# EAGLE design main (EAGLE 7.4.0)
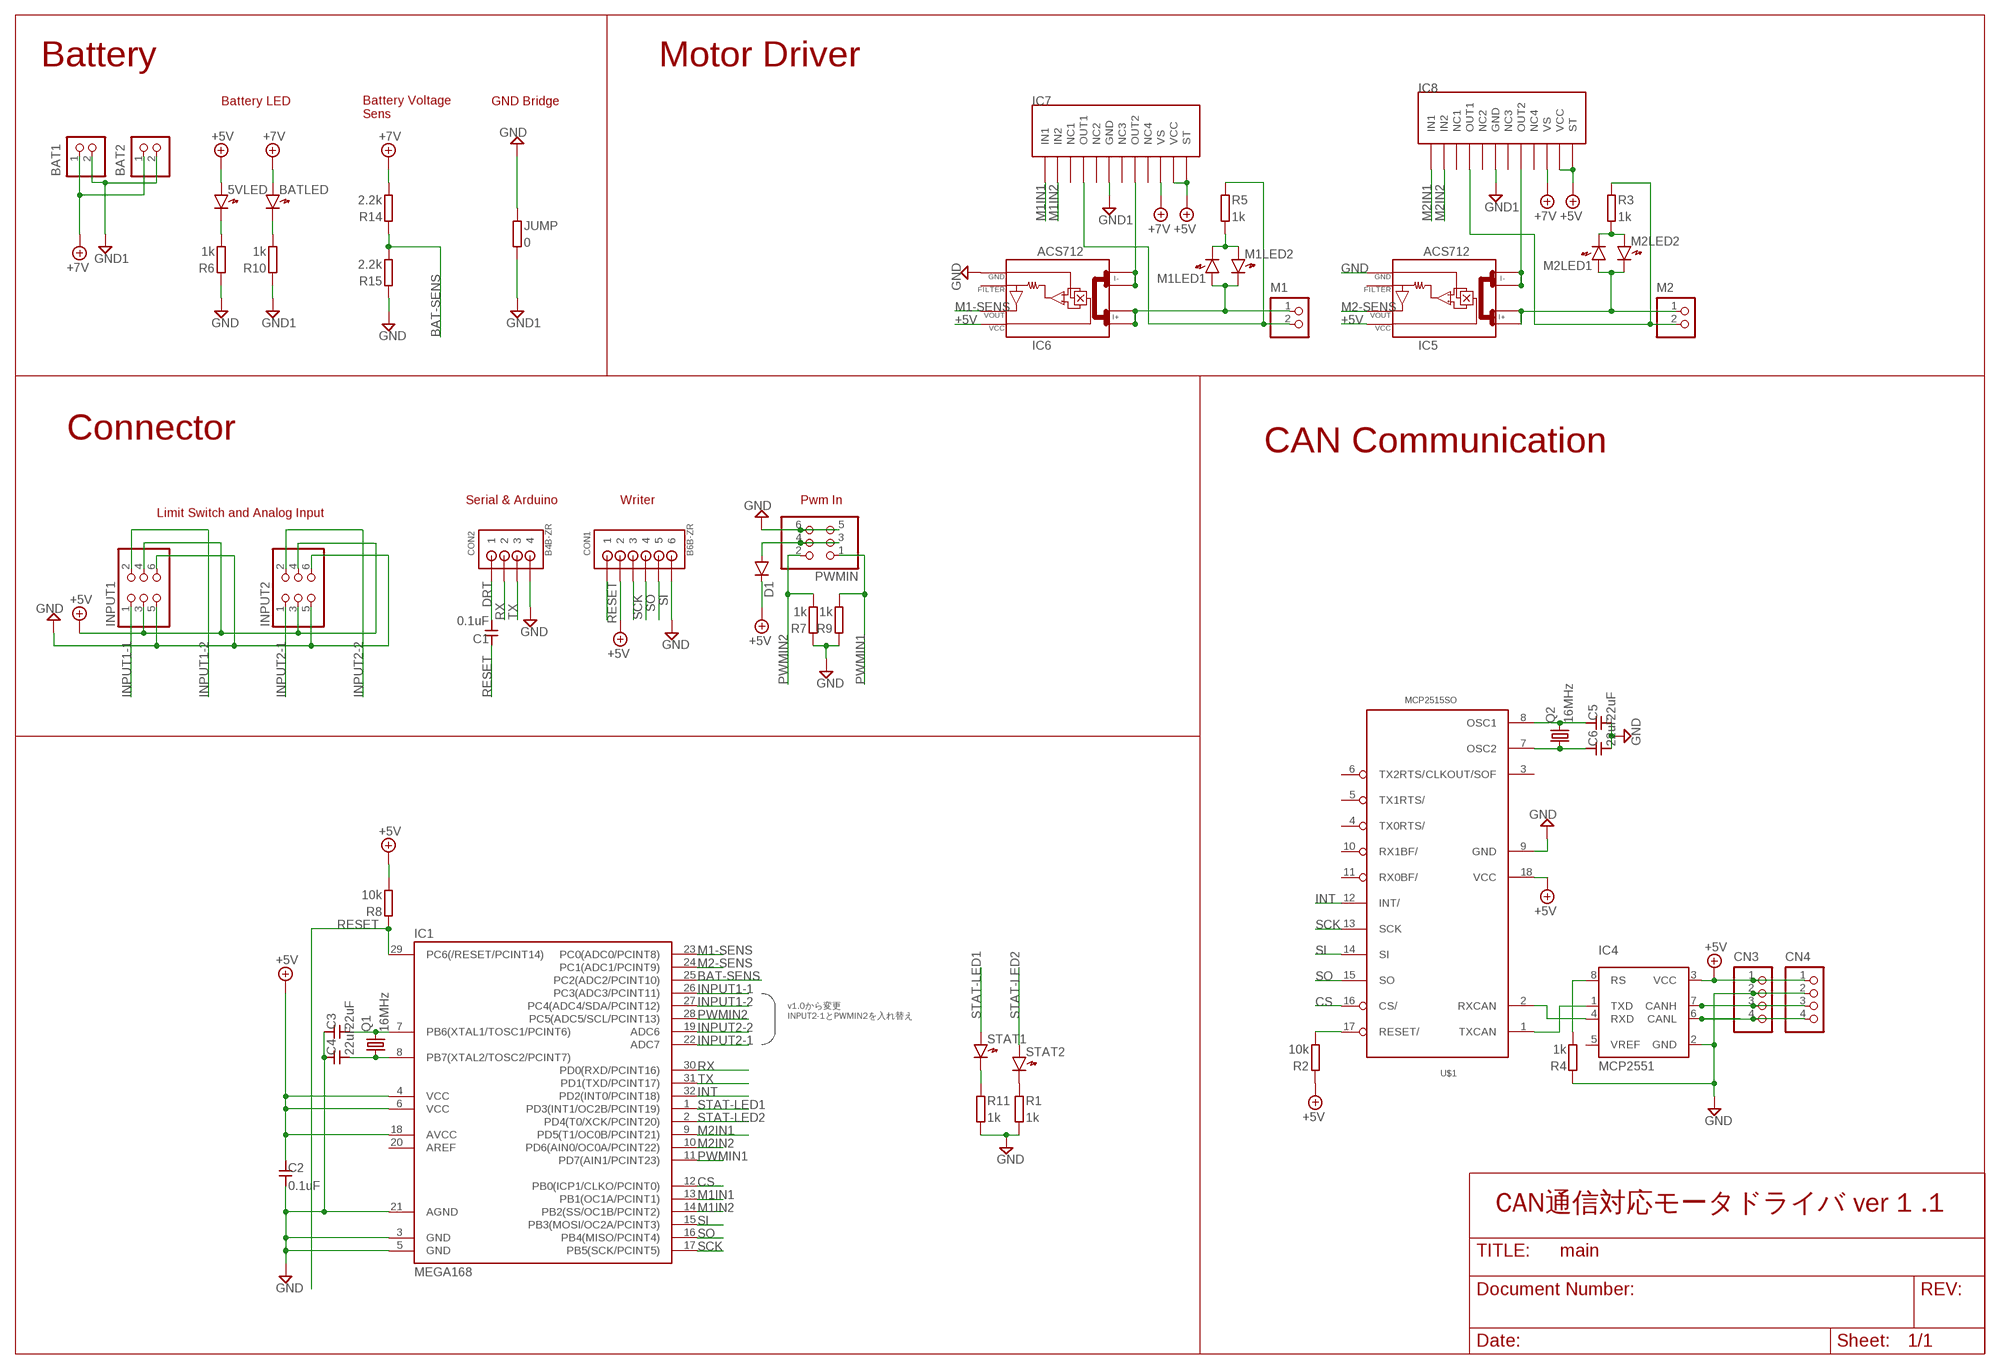
[diagram p0: schematic, sheet 1]

## Parts
5VLED  LED2012  [LED2012]
BAT1  B2P-VH  [B2P-VH]
BAT2  B2P-VH  [B2P-VH]
BATLED  LED2012  [LED2012]
C1  0.1uF  CAPACITOR2012  [SMD2012]
C2  0.1uF  CAPACITOR2012  [SMD2012]
C3  22uF  CAPACITOR2012  [SMD2012]
C4  22uF  CAPACITOR2012  [SMD2012]
C5  22uF  CAPACITOR2012  [SMD2012]
C6  22uF  CAPACITOR2012  [SMD2012]
CN3  B4B-PH-K-S  [B4B-PH-K-S]
CN4  B4B-PH-K-S  [B4B-PH-K-S]
CON1  B6B-ZR  [B6B-ZR]
CON2  B4B-ZR  [B4B-ZR]
D1  DIODESOD123  [SOD-123]
IC1  MEGA168  MEGA48/88/168-AU  [TQFP32-08]
IC4  MCP2551  [SOIC]
IC5  ACS712  [SO08]
IC6  ACS712  [SO08]
IC7  TA8429H  [TA8429H]
IC8  TA8429H  [TA8429H]
INPUT1  PINHD-2X3  [2X03]
INPUT2  PINHD-2X3  [2X03]
JUMP  0  RESISTOR2012  [SMD2012]
M1  B2P-VH  [B2P-VH]
M1LED1  LED2012  [LED2012]
M1LED2  LED2012  [LED2012]
M2  B2P-VH  [B2P-VH]
M2LED1  LED2012  [LED2012]
M2LED2  LED2012  [LED2012]
PWMIN  PINHD-2X3  [2X03]
Q1  16MHz  CRYSTALHC49S  [HC49/S]
Q2  16MHz  CRYSTALHC49S  [HC49/S]
R1  1k  RESISTOR2012  [SMD2012]
R2  10k  RESISTOR2012  [SMD2012]
R3  1k  RESISTOR2012  [SMD2012]
R4  1k  RESISTOR2012  [SMD2012]
R5  1k  RESISTOR2012  [SMD2012]
R6  1k  RESISTOR2012  [SMD2012]
R7  1k  RESISTOR2012  [SMD2012]
R8  10k  RESISTOR2012  [SMD2012]
R9  1k  RESISTOR2012  [SMD2012]
R10  1k  RESISTOR2012  [SMD2012]
R11  1k  RESISTOR2012  [SMD2012]
R14  2.2k  RESISTOR2012  [SMD2012]
R15  2.2k  RESISTOR2012  [SMD2012]
STAT1  LED2012  [LED2012]
STAT2  LED2012  [LED2012]
U$1  MCP2515SO  [SO18L]

## Nets
+5V: 5VLED.A C2.1 CN3.1 CN4.1 CON1.2 D1.C IC1.4(VCC) IC1.6(VCC) IC1.18(AVCC) IC4.3(VCC) IC5.8(VCC) IC6.8(VCC) IC7.P$11(VCC) IC7.P$12(ST) IC8.P$11(VCC) IC8.P$12(ST) INPUT1.3 INPUT1.4 INPUT2.3 INPUT2.4 R2.1 R8.2 U$1.18(VCC)
+7V: BAT1.1 BAT2.1 BATLED.A IC7.P$10(VS) IC8.P$10(VS) R14.2
BAT-SENS: IC1.25(PC2(ADC2/PCINT10)) R14.1 R15.2
CS: IC1.12(PB0(ICP1/CLKO/PCINT0)) U$1.16(CS/)
DRT: C1.2 CON2.1
GND: C2.2 C3.1 C4.1 C5.2 C6.2 CN3.2 CN4.2 CON1.6 CON2.4 IC1.3(GND) IC1.5(GND) IC1.21(AGND) IC4.2(GND) IC5.5(GND) IC6.5(GND) INPUT1.5 INPUT1.6 INPUT2.5 INPUT2.6 JUMP.1 PWMIN.5 PWMIN.6 R1.2 R4.1 R6.1 R7.1 R9.1 R11.2 R15.1 U$1.9(GND)
INPUT1-1: IC1.26(PC3(ADC3/PCINT11)) INPUT1.1
INPUT1-2: IC1.27(PC4(ADC4/SDA/PCINT12)) INPUT1.2
INPUT2-1: IC1.22(ADC7) INPUT2.1
INPUT2-2: IC1.19(ADC6) INPUT2.2
INT: IC1.32(PD2(INT0/PCINT18)) U$1.12(INT/)
M1-SENS: IC1.23(PC0(ADC0/PCINT8)) IC6.7(VOUT)
M1IN1: IC1.13(PB1(OC1A/PCINT1)) IC7.P$1(IN1)
M1IN2: IC1.14(PB2(SS/OC1B/PCINT2)) IC7.P$2(IN2)
M2-SENS: IC1.24(PC1(ADC1/PCINT9)) IC5.7(VOUT)
M2IN1: IC1.9(PD5(T1/OC0B/PCINT21)) IC8.P$1(IN1)
M2IN2: IC1.10(PD6(AIN0/OC0A/PCINT22)) IC8.P$2(IN2)
MGND [GND_MOTOR]: BAT1.2 BAT2.2 IC7.P$6(GND) IC8.P$6(GND) JUMP.2 R10.1 ; supply symbol labelled GND1
N$1: C3.2 IC1.7(PB6(XTAL1/TOSC1/PCINT6)) Q1.2
N$2: C4.2 IC1.8(PB7(XTAL2/TOSC2/PCINT7)) Q1.1
N$3 [V_MOTOR]: IC8.P$4(OUT1) M2.2 R3.1
N$4: IC6.1(I+_0) IC6.2(I+_1) M1.1 M1LED1.A M1LED2.K
N$5: D1.A PWMIN.3 PWMIN.4
N$7 [V_MOTOR]: IC5.1(I+_0) IC5.2(I+_1) M2.1 M2LED1.A M2LED2.K
N$13: IC4.1(TXD) U$1.1(TXCAN)
N$14: IC4.4(RXD) U$1.2(RXCAN)
N$21: 5VLED.K R6.2
N$28: R1.1 STAT2.K
N$32: CN3.4 CN4.4 IC4.6(CANL)
N$33: CN3.3 CN4.3 IC4.7(CANH)
N$34: M1LED1.K M1LED2.A R5.2
N$35 [GND_MOTOR]: IC7.P$4(OUT1) M1.2 R5.1
N$38: R2.2 U$1.17(RESET/)
N$39: M2LED1.K M2LED2.A R3.2
N$40: C6.1 Q2.1 U$1.7(OSC2)
N$41: BATLED.K R10.2
N$42: IC6.3(I-_0) IC6.4(I-_1) IC7.P$8(OUT2)
N$43: IC5.3(I-_0) IC5.4(I-_1) IC8.P$8(OUT2)
N$44: C5.1 Q2.2 U$1.8(OSC1)
N$45: IC4.8(RS) R4.2
N$47: R11.1 STAT1.K
PWMIN1: IC1.11(PD7(AIN1/PCINT23)) PWMIN.1 R9.2
PWMIN2: IC1.28(PC5(ADC5/SCL/PCINT13)) PWMIN.2 R7.2
RESET: C1.1 CON1.1 IC1.29(PC6(/RESET/PCINT14)) R8.1
RX: CON2.2 IC1.30(PD0(RXD/PCINT16))
SCK: CON1.3 IC1.17(PB5(SCK/PCINT5)) U$1.13(SCK)
SI: CON1.5 IC1.15(PB3(MOSI/OC2A/PCINT3)) U$1.14(SI)
SO: CON1.4 IC1.16(PB4(MISO/PCINT4)) U$1.15(SO)
STAT-LED1: IC1.1(PD3(INT1/OC2B/PCINT19)) STAT1.A
STAT-LED2: IC1.2(PD4(T0/XCK/PCINT20)) STAT2.A
TX: CON2.3 IC1.31(PD1(TXD/PCINT17))
Unconnected: IC1.20(AREF) IC4.5(VREF) IC5.6(FILTER) IC6.6(FILTER) IC7.P$3(NC1) IC7.P$5(NC2) IC7.P$7(NC3) IC7.P$9(NC4) IC8.P$3(NC1) IC8.P$5(NC2) IC8.P$7(NC3) IC8.P$9(NC4) U$1.3(CLKOUT/SOF) U$1.4(TX0RTS/) U$1.5(TX1RTS/) U$1.6(TX2RTS/) U$1.10(RX1BF/) U$1.11(RX0BF/)

## Notes on the sheet
- Battery | Motor Driver
- Battery LED | GND Bridge
- Battery Voltage
  Sens
- Connector
- CAN Communication
- Serial & Arduino | Writer | Pwm In
- Limit Switch and Analog Input
- v1.0から変更
  INPUT2-1とPWMIN2を入れ替え
- CAN通信対応モータドライバ ver 1 .1

## Library data of the parts
5VLED BATLED M1LED1 M1LED2 M2LED1 M2LED2 STAT1 STAT2 = generic:LED: Generic LEDs
BAT1 BAT2 M1 M2 = jst-vh:B2P-VH: Wire-to-Board 3.96mm pitch top mount connector Source: http://www.jst-mfg.com/product/pdf/jpn/VH.pdf http://www.jst-mfg.com/product/detail.php?series=262
C1-C6 = generic:CAPACITOR: Generic Capacitor
CN3 CN4 = jst-ph:B4B-PH-*: Wire-to-Board 2.0mm pitch top mount connector Source: http://www.jst-mfg.com/product/pdf/jpn/PH.pdf http://www.jst-mfg.com/product/detail.php?series=199
CON1 = jst:B6B-ZR: JST-ZH Connector 6 pol, 1.5mm pitch Package: B6B-ZR Source: http://www.jst-mfg.com/product/pdf/eng/eZH.pdf
CON2 = jst:B4B-ZR: JST-ZH Connector 4 pol, 1.5mm pitch Package: B4B-ZR Source: http://www.jst-mfg.com/product/pdf/eng/eZH.pdf
D1 = SparkFun-DiscreteSemi:DIODE: Diode These are standard reverse protection diodes and small signal diodes. SMA package can handle up to about 1A. SOD-323 can handle about 200mA. What the SOD-323 package when ordering, there are some mfgs out there that are 5-pin packages.
IC1 = avr-5:MEGA48/88/168
IC4 = mcp2551:MCP2551
IC5 IC6 = ACS712:ACS712
IC7 IC8 = TA8429H:TA8429H: TA8429H Toshiba motor driver.
INPUT1 INPUT2 PWMIN = pinhead:PINHD-2X3: PIN HEADER
JUMP R1-R11 R14 R15 = generic:RESISTOR: Generic Registor
Q1 Q2 = crystal:CRYSTAL: CRYSTAL; OC_FARNELL: 1667008; OC_NEWARK: unknown
U$1 = MCP2515_MT:MCP2515*: MCP2515 Standalone CAN-Controller by Microchip Eagle-Lib. by MartinThomas

## Board
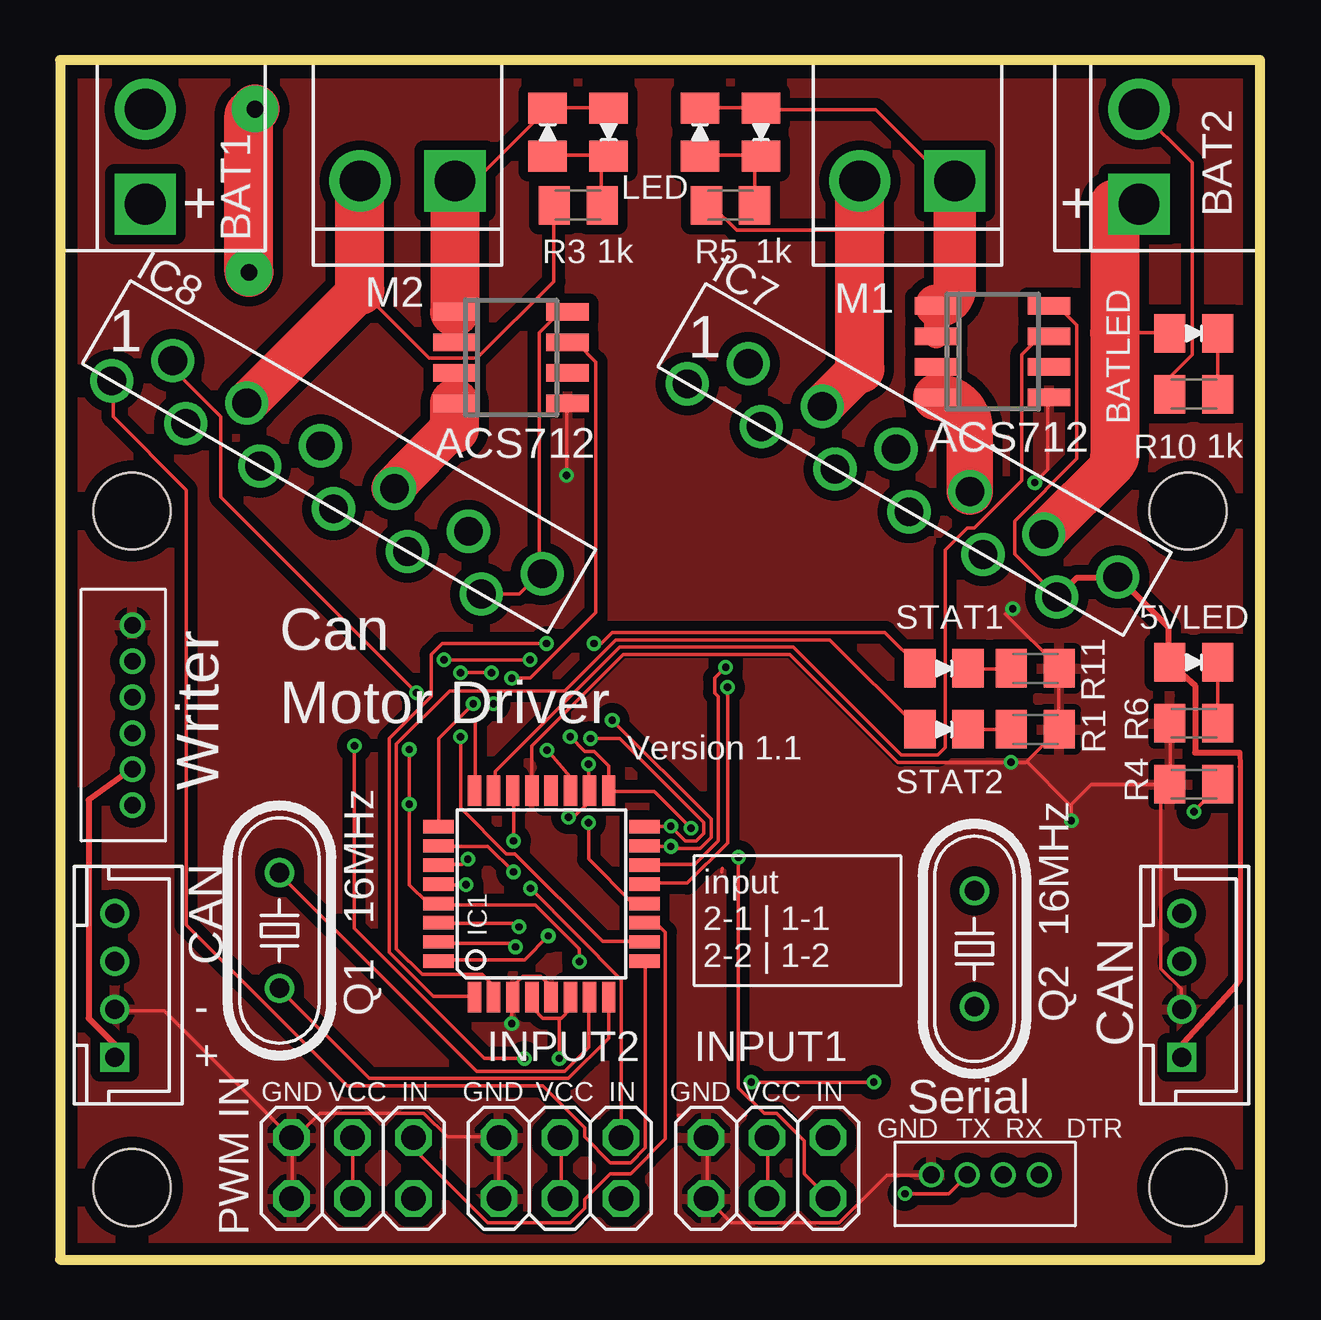
[diagram p1: board, top side]
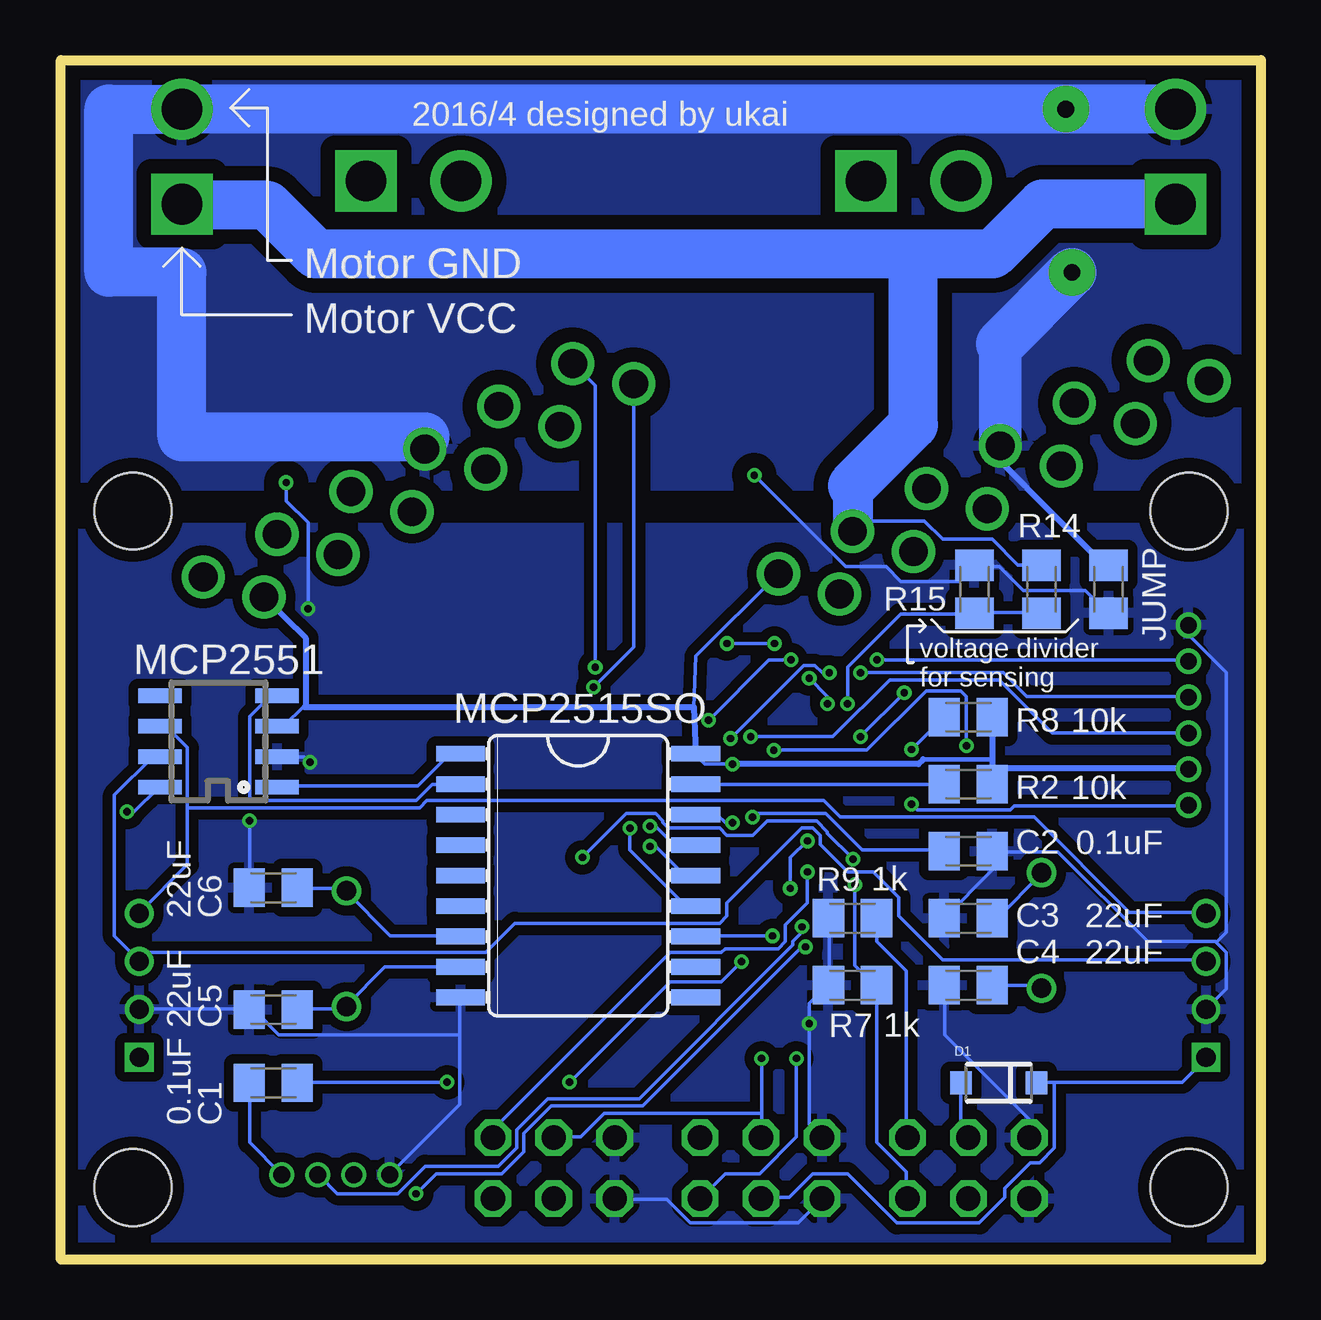
[diagram p2: board, bottom side, seen from below]

Size 50 x 50 mm. Coordinates in mm from the lower left corner, seen from the top.
Outline: 0,0 50,0 50,50 0,50 0,0
Copper layers (1*16): Top 0.035mm / dielectric 1.6mm / Bottom 0.035mm
Design rules "Elecrow_2-layer_PCB_eagle_rule": minimum track width 6mil, minimum drill 12mil, track to track 6mil, track to pad 6mil, pad to pad 6mil, via to via 8mil, smd to smd 0mil, copper to edge 20mil, drill to drill 10mil, minimum pad ring 6mil, minimum via ring 6mil, stop-mask expansion 0mil, vias tented up to drill 100mil, thermal gap 10mil
Holes 3.2 mm at 3,3 47,3 3,31.2 47,31.2

### Footprints (pad centres in the part's own frame; a part is rotated, then mirrored left to right if it is on the bottom)
LED2012 = smd 1.3 x 1.6: A -1,0; K 1,0
B2P-VH = drill 1.7 square: 1 -1.98,0 | drill 1.7: 2 1.98,0
SMD2012 = smd 1.3 x 1.6: 1 -1,0; 2 1,0
B4B-PH-K-S = drill 0.8 square: 1 -3,0 | drill 0.8: 2 -1,0; 3 1,0; 4 3,0
B6B-ZR = drill 0.7: 1 9,-1.3; 2 7.5,-1.3; 3 6,-1.3; 4 4.5,-1.3; 5 3,-1.3; 6 1.5,-1.3
B4B-ZR = drill 0.7: 1 6,-1.3; 2 4.5,-1.3; 3 3,-1.3; 4 1.5,-1.3
SOD-123 = smd 0.9 x 0.95: A 1.575,0; C -1.575,0
TQFP32-08 = smd 1.27 x 0.559: 1 -4.293,2.8; 2 -4.293,2; 3 -4.293,1.2; 4 -4.293,0.4; 5 -4.293,-0.4; 6 -4.293,-1.2; 7 -4.293,-2; 8 -4.293,-2.8; 17 4.293,-2.8; 18 4.293,-2; 19 4.293,-1.2; 20 4.293,-0.4; 21 4.293,0.4; 22 4.293,1.2; 23 4.293,2; 24 4.293,2.8 | smd 0.559 x 1.27: 9 -2.8,-4.293; 10 -2,-4.293; 11 -1.2,-4.293; 12 -0.4,-4.293; 13 0.4,-4.293; 14 1.2,-4.293; 15 2,-4.293; 16 2.8,-4.293; 25 2.8,4.293; 26 2,4.293; 27 1.2,4.293; 28 0.4,4.293; 29 -0.4,4.293; 30 -1.2,4.293; 31 -2,4.293; 32 -2.8,4.293
SOIC = smd 0.6 x 1.8: 1 -1.905,-2.44; 2 -0.635,-2.44; 3 0.635,-2.44; 4 1.905,-2.44; 5 1.905,2.44; 6 0.635,2.44; 7 -0.635,2.44; 8 -1.905,2.44
SO08 = smd 0.72 x 1.78: 1 -1.905,-2.35; 2 -0.635,-2.35; 3 0.635,-2.35; 4 1.905,-2.35; 5 1.905,2.35; 6 0.635,2.35; 7 -0.635,2.35; 8 -1.905,2.35
TA8429H = drill 1.2: P$1 0,0; P$2 1.778,2; P$3 3.556,0; P$4 5.334,2; P$5 7.112,0; P$6 8.89,2; P$7 10.668,0; P$8 12.446,2; P$9 14.224,0; P$10 16.002,2; P$11 17.78,0; P$12 19.558,2
2X03 = drill 1.016 octagon: 1 -2.54,-1.27; 2 -2.54,1.27; 3 0,-1.27; 4 0,1.27; 5 2.54,-1.27; 6 2.54,1.27
HC49/S = drill 0.813: 1 -2.413,0; 2 2.413,0
SO18L = smd 0.66 x 2.032: 1 -5.08,-4.902; 2 -3.81,-4.902; 3 -2.54,-4.902; 4 -1.27,-4.902; 5 0,-4.902; 6 1.27,-4.902; 7 2.54,-4.902; 8 3.81,-4.902; 9 5.08,-4.902; 10 5.08,4.902; 11 3.81,4.902; 12 2.54,4.902; 13 1.27,4.902; 14 0,4.902; 15 -1.27,4.902; 16 -2.54,4.902; 17 -3.81,4.902; 18 -5.08,4.902

### Placement (x,y rotation side)
5VLED  47.24,24.89 0 top
BAT1  3.56,45.97 90 top
BAT2  44.96,45.97 90 top
BATLED  47.24,38.61 0 top
C1  41.15,7.37 180 bottom
C2  12.19,17.02 0 bottom
C3  12.19,14.22 0 bottom
C4  12.19,11.43 0 bottom
C5  41.15,10.41 180 bottom
C6  41.15,15.49 180 bottom
CN3  46.74,11.43 90 top
CN4  2.29,11.43 90 top
CON1  4.32,27.94 270 top
CON2  34.8,4.83 0 top
D1  10.92,7.37 180 bottom
IC1  20.07,15.24 90 top
IC4  43.43,21.59 90 bottom
IC5  18.8,37.59 270 top
IC6  38.86,37.85 270 top
IC7  26.14,36.5 330 top
IC8  2.16,36.63 330 top
INPUT1  29.46,3.81 180 top
INPUT2  20.83,3.81 180 top
JUMP  6.35,27.94 90 bottom
M1  35.31,44.96 180 top
M1LED1  29.21,46.99 270 top
M1LED2  26.67,46.99 90 top
M2  14.48,44.96 180 top
M2LED1  22.86,46.99 270 top
M2LED2  20.32,46.99 90 top
PWMIN  12.19,3.81 180 top
Q1  9.14,13.72 90 top
Q2  38.1,12.95 270 top
R1  40.64,22.1 0 top
R2  12.19,19.81 180 bottom
R3  21.59,43.94 0 top
R4  47.24,19.81 0 top
R5  27.94,43.94 0 top
R6  47.24,22.35 0 top
R7  17.02,11.43 0 bottom
R8  12.19,22.61 0 bottom
R9  17.02,14.22 0 bottom
R10  47.24,36.07 0 top
R11  40.64,24.64 0 top
R14  9.14,27.94 90 bottom
R15  11.94,27.94 270 bottom
STAT1  36.83,24.64 0 top
STAT2  36.83,22.1 0 top
U$1  28.45,16 270 bottom

### Tracks (layer width: path | path; a pad name or v marks a point on that pad's centre or on a via)
+5V  (via drill 0.3)
  Top 0.152: IC6.8 41.22,39.7 41.6,39.7 42.37,38.94 42.37,33.38 39.78,30.79 39.78,29.41 41.53,27.66 IC7.P$11 41.6,27.66 | 46.18,24.92 5VLED.A 46.25,24.84 | 46.79,8.46 CN3.1 | v22.02,20.65 22.02,19.58 IC1.18 22.02,19.51 22.02,19.05 21.41,18.44 v21.18,18.44 | 20.04,28.57 20,28.61 | 20,28.61 19.96,28.65 19.96,38.63 20.8,39.47 21.11,39.47 IC5.8 | INPUT1.4 29.49,2.59 29.49,5.03 INPUT1.3 | 20.8,10.06 20.88,10.06 21.26,10.44 21.26,10.9 IC1.6 | 20.8,10.06 20.12,10.06 19.74,10.44 19.74,10.9 IC1.4 | v20.8,8.38 20.8,10.06 | INPUT2.4 20.88,2.59 20.88,5.03 INPUT2.3 | 2.97,20.42 CON1.2 | IC8.P$11 17.6,27.74 19.13,27.74 19.96,28.57 IC8.P$12 20.04,28.65 20,28.61 | 44.12,28.42 IC7.P$12 44.04,28.42
  Top 0.203: 49.15,21.13 49.17,20.55 49.17,11.66 49.02,11.48 49.02,11.46
  Top 0.254: 46.18,24.92 46.18,26.36 44.12,28.42 | 46.79,8.46 46.81,9.02 49.02,11.46 | 49.15,21.13 47.3,21.13 47.3,23.93 46.25,24.84 | CN4.1 2.29,8.97 1.19,10.06 1.19,19.15 2.97,20.42 | 44.04,28.42 42.37,28.42 41.6,27.66
  Bottom 0.152: 39.8,23.09 39.89,23.05 | 39.89,23.05 40.69,22.25 40.92,22.25 IC4.3 | v22.02,20.65 23.16,20.65 23.55,21.03 U$1.18 | v21.18,18.44 21.03,18.59 18.14,18.59 16.61,17.07 13.26,17.07 C2.1 | 23.62,23.01 23.55,25.15 20.12,28.57 IC8.P$12 | 20.8,6.1 20.8,5.11 INPUT2.3 | 20.8,6.1 v20.8,8.38 | 20.8,6.1 27.36,6.1 28.35,5.11 29.41,5.11 INPUT1.3 | 8.61,7.39 3.28,7.39 2.29,8.38 CN4.1 | 8.61,7.39 9.3,7.39 D1.C | 11.2,22.55 R8.2 | 3.05,20.5 CON1.2 | 8.61,7.39 8.61,4.65 9.22,4.04 9.6,4.04 10.67,2.97 10.67,2.59 11.73,1.52 15.16,1.52 17.22,3.58 18.67,3.58 19.66,2.59 20.8,2.59 INPUT2.4 | 39.85,23.01 39.89,23.05 | 41.53,27.58 IC7.P$11 | 11.2,20.5 11.2,19.81 R2.1 11.2,20.5
  Bottom 0.178: 11.2,20.85 14.07,20.85
  Bottom 0.254: 39.8,23.09 39.8,25.91 41.53,27.58 | U$1.18 23.62,23.01 39.85,23.01 | 11.2,22.55 11.2,20.85 11.2,20.5 3.05,20.5 | v22.02,20.65 14.28,20.65 14.07,20.85
+7V
  Top 0.152: 46.18,38.63 BATLED.A 46.1,38.63 43.94,38.63 | 41,30.25 IC7.P$10
  Top 1.778: 41,30.25 43.94,33.2 43.94,33.43
  Top 2.032: BAT2.1 43.94,43.99 43.94,38.63 43.94,33.43
  Bottom 0.152: R14.2 9.14,28.96 10.13,28.96 11.2,30.02 13.26,30.02 14.02,30.79 16.23,30.79 IC8.P$10
  Bottom 1.676: 17.02,32.26 IC8.P$10
  Bottom 2.032: BAT1.1 9.09,43.99 11.18,41.91 14.73,41.91 | 14.73,41.91 39.37,41.91 41.4,43.94 44.91,43.94 BAT2.1 | 17.02,32.26 14.48,34.8 14.48,41.66 14.73,41.91
BAT-SENS  (via drill 0.3)
  Top 0.152: v17.22,23.16 15.77,21.72 IC1.25
  Bottom 0.152: v17.22,23.16 17.22,24.69 15.01,26.9 11.96,26.9 R15.2 11.89,26.98 9.14,26.98 R14.1
CS  (via drill 0.3)
  Top 0.152: v22.02,18.21 22.02,16.69 23.85,14.86 24.31,14.86 IC1.12
  Bottom 0.152: v22.02,18.21 22.33,18.21 22.63,18.52 23.55,18.52 U$1.16
DRT
  Bottom 0.152: C1.2 42.14,7.32 42.14,4.88 40.84,3.58 CON2.1
GND  (via drill 0.3)
  Top 0.152: 41.6,22.1 41.6,24.61 R11.2 41.6,24.69 39.43,26.86 | R6.1 46.25,22.33 46.25,19.81 R4.1 | IC1.5 20.42,10.97 20.42,11.43 20.04,11.81 19.28,11.81 18.9,11.43 18.9,10.97 IC1.3 18.82,10.9 v18.82,9.83 | 41.6,22.1 40.27,20.77 | 40.27,20.77 40.23,20.73 v39.62,20.73 34.9,20.73 30.4,25.22 23.47,25.22 19.66,21.41 19.66,19.58 IC1.21 | 41.6,22.1 R1.2 | v42.14,18.29 42.14,18.9 42.1,18.94 | 40.27,20.77 42.1,18.94 | 39.43,26.86 39.4,26.9 | 41.15,35.89 IC6.5 41.15,35.81 41.15,32.92 v40.62,32.38 | 45.87,19.81 42.98,19.81 42.1,18.94 | 45.87,19.81 R4.1 | 45.87,19.81 45.87,12.12 46.71,11.28 46.71,10.44 CN3.2 | 46.18,19.81 R4.1 | INPUT2.6 INPUT2.5 18.29,5.11 16.15,5.11 15.16,6.1 10.82,6.1 9.75,5.03 PWMIN.5 | CN4.2 2.29,10.36 4.34,10.36 9.6,5.11 PWMIN.5 | PWMIN.6 9.68,2.59 9.68,5.03 PWMIN.5 | CON2.4 36.27,3.5 34.44,3.5 32.46,1.52 27.96,1.52 26.98,2.52 INPUT1.6 26.98,2.59 26.98,5.03 INPUT1.5 26.9,5.64 | 25.76,6.02 25.91,6.02 | 27.58,16.31 27.57,16.17 | 28.57,6.02 28.45,6.01 | v21.11,32.69 21.11,35.66 IC5.5 | 39.43,26.86 v39.7,27.13
  Bottom 0.152: C5.2 42.22,10.44 46.71,10.44 CN3.2 | 33.38,9.37 33.38,6.48 36.27,3.58 CON2.4 | 33.38,9.37 33.38,10.9 U$1.9 | 33.38,9.37 40.92,9.37 41.91,10.36 42.14,10.36 C5.2 | v42.14,18.29 42.14,15.54 C6.2 | IC4.2 39.85,20.95 v39.62,20.73 | R9.1 17.98,14.17 17.98,11.43 R7.1 18.06,11.43 18.82,10.67 v18.82,9.83 18.82,5.64 18.29,5.11 INPUT2.5 | INPUT1.6 26.9,2.52 24.77,2.52 23.77,1.52 19.28,1.52 18.29,2.52 INPUT2.6 | C3.1 13.18,14.25 11.2,16.23 11.2,16.99 C2.2 11.12,16.99 8.46,16.99 4.72,13.26 1.91,13.26 1.87,13.22 | C4.1 13.18,9.37 9.68,5.87 9.68,5.11 PWMIN.5 | 1.87,13.22 1.45,12.8 1.45,11.28 CN4.2 | 1.87,13.22 1.45,13.64 1.45,24.46 2.97,25.98 2.97,26.36 CON1.6 | v21.11,32.69 17.3,28.88 15.62,28.88 15.01,28.27 12.57,28.27 11.96,28.88 R15.1 11.89,28.88 10.9,28.88 9.91,27.89 7.32,27.89 6.4,26.98 JUMP.1 | v40.62,32.38 40.62,31.62 39.7,30.71 v39.7,27.13 | C5.2 42.14,10.44 42.03,10.54
  pour Top (isolate 0.406): 0.76,49.02 49.28,49.02 49.28,0.76 0.76,0.76
  pour Bottom (isolate 0.406): 0.76,30.48 49.28,30.48 49.28,0.76 0.76,0.76
INPUT1-1  (via drill 0.3)
  Top 0.152: v18.9,16.15 17.83,17.22 15.77,17.22 IC1.26
  Bottom 0.152: v18.9,16.15 18.9,14.86 19.81,13.95 19.81,13.26 20.12,12.95 22.33,12.95 22.48,12.8 24.61,12.8 32,5.41 INPUT1.1
INPUT1-2  (via drill 0.3)
  Top 0.152: v16.99,16.69 16.76,16.46 15.77,16.46 IC1.27 | v28.27,16.76 28.27,7.16 29.34,6.1 29.87,6.1 31.01,4.95 31.01,3.58 32,2.59 INPUT1.2
  Bottom 0.152: v16.99,16.69 18.06,17.75 18.06,17.83 18.52,18.29 20.57,18.29 21.18,17.68 22.25,17.68 22.55,17.98 24.69,17.98 24.92,18.21 24.92,18.29 25.22,18.59 26.44,18.59 v28.27,16.76
INPUT2-1  (via drill 0.3)
  Top 0.152: v19.61,15.47 23.39,11.66 23.39,5.11 23.37,5.11 INPUT2.1 | v18.9,17.45 18.9,19.53 IC1.22
  Bottom 0.152: v19.61,15.47 19.61,16.76 v18.9,17.45
INPUT2-2  (via drill 0.3)
  Top 0.152: v20.3,21.23 21.26,20.12 21.26,19.58 21.27,19.58 IC1.19 | v12.27,21.41 12.27,13.79 17.68,8.38 v19.36,8.38
  Bottom 0.152: v20.3,21.23 16.43,21.23 13.95,23.7 12.5,23.7 12.27,23.47 v12.27,21.41 | v19.36,8.38 19.36,5.11 20.88,3.58 22.33,3.58 INPUT2.2
INT  (via drill 0.3)
  Top 0.152: v20.34,13.49 19.36,12.5 15.77,12.5 IC1.32
  Bottom 0.152: v20.34,13.49 23.55,13.49 U$1.12
M1-SENS
  Top 0.152: IC6.7 40.84,38.48 40.08,37.72 40.08,32.46 38.1,30.48 37.8,30.48 36.88,29.57 36.88,21.34 36.58,21.03 35.05,21.03 30.56,25.53 23.32,25.53 18.14,20.34 18.14,19.58 IC1.23
M1IN1  (via drill 0.3)
  Top 0.152: v27.81,23.85 27.81,17.37 26.14,15.7 24.38,15.7 IC1.13
  Bottom 0.152: v27.81,23.85 26.14,25.53 IC7.P$1
M1IN2  (via drill 0.3)
  Top 0.152: v27.74,24.69 27.28,24.23 27.28,23.62 27.43,23.47 27.43,17.45 26.44,16.46 24.38,16.46 IC1.14
  Bottom 0.152: v27.74,24.69 27.74,36.42 28.65,37.34 IC7.P$2
M2-SENS  (via drill 0.3)
  Top 0.152: v18.06,23.16 17.3,22.4 17.3,19.58 IC1.24 | v18.82,24.23 19.58,24.23 22.33,26.98 22.33,37.41 21.57,38.18 21.18,38.18 IC5.7
  Bottom 0.152: v18.06,23.16 18.06,23.47 v18.82,24.23
M2IN1
  Top 0.152: IC1.9 24.38,12.42 24.38,4.65 23.77,4.04 22.94,4.04 21.87,5.11 21.87,5.49 20.12,7.24 11.96,7.24 5.26,13.95 5.26,32.08 2.21,35.13 2.21,36.58 IC8.P$1
M2IN2  (via drill 0.3)
  Top 0.152: v16.69,21.79 16.69,18.82 18.59,16.92 18.95,16.92 22.61,13.26 24.31,13.26 IC1.10 | 4.72,36.96 4.72,37.41 IC8.P$2 4.72,36.96 | 4.72,36.96 4.88,36.96 6.71,35.13 6.71,31.77 v14.86,23.62
  Bottom 0.152: v14.86,23.62 v16.69,21.79
MGND  (via drill 0.7 pad 1.93)
  Top 0.152: R10.1 46.25,36.12 46.25,36.8 47.17,37.72 47.17,45.72 44.96,47.93 BAT2.2
  Top 2.032: v7.87,41.15 7.87,47.7 v8.13,47.95
  Bottom 0.152: 9.75,32.16 9.84,32.26
  Bottom 0.254: IC8.P$6 10.86,33.28 9.84,32.26 | JUMP.2 6.54,28.94 9.75,32.16
  Bottom 1.778: IC8.P$6 10.86,38.16 | 10.86,38.16 | 34.83,34.29 IC7.P$6
  Bottom 2.032: BAT1.2 v8.13,47.95 BAT2.2 48.01,47.95 48.01,41.15 44.96,41.15 44.96,34.29 34.83,34.29 | 10.86,38.16 v7.87,41.15
  pour Bottom (isolate 0.61): 0.76,49.28 49.28,49.28 49.28,32.26 0.76,32.26
N$1
  Top 0.152: IC1.7 22.02,10.9 22.02,8.84 21.03,7.85 17.37,7.85 9.14,16.08 Q1.2
  Bottom 0.152: C3.2 11.12,14.25 10.97,14.25 9.14,16.08 Q1.2
N$2
  Top 0.152: IC1.8 22.86,10.9 22.86,9.22 21.18,7.54 12.88,7.54 9.14,11.28 Q1.1
  Bottom 0.152: C4.2 9.22,11.43 9.14,11.35 Q1.1
N$3
  Top 0.152: 12.5,40.4 13.26,39.78 13.26,39.7 15.39,37.57 17.37,37.57 20.57,40.77 20.57,43.89 R3.1 | 7.85,35.74 IC8.P$4
  Top 1.778: 7.8,35.69 IC8.P$4 12.5,40.4
  Top 2.032: 12.5,40.4 M2.2
N$4
  Top 0.152: 29.18,48.01 M1LED1.A | M1LED2.K 26.67,48.01 29.11,48.01 M1LED1.A | M1LED1.A 29.26,47.93 33.98,47.93 36.42,45.49 M1.1
  Top 1.016: IC6.1 IC6.2
  Top 1.778: M1.1 37.29,40.52 arc-90 IC6.1
N$5
  Top 0.152: PWMIN.3 PWMIN.4
  Bottom 0.152: D1.A 12.5,7.32 12.5,5.41 12.19,5.11 PWMIN.3
N$7
  Top 0.152: M2.1 17.45,45.11 20.27,47.93 M2LED2.K 20.34,48.01 22.86,48.01 M2LED1.A
  Top 0.61: IC5.1 IC5.2
  Top 2.032: M2.1 16.45,44.96 IC5.1
N$13
  Bottom 0.152: IC4.1 40.92,19.74 35.13,19.74 33.83,21.03 33.38,21.03 U$1.1
N$14
  Bottom 0.152: U$1.2 34.52,19.81 35.2,19.13 41.99,19.13 42.14,19.28 42.14,22.63 41.3,23.47 41,23.47 IC4.4
N$21
  Top 0.152: R6.2 48.23,22.4 48.23,24.84 5VLED.K
N$28
  Top 0.152: R1.1 STAT2.K
N$32
  Bottom 0.152: 44.73,18.82 44.73,16.46 46.71,14.48 CN3.4 | 44.73,18.82 44.73,21.34 45.57,22.17 45.87,22.17 IC4.6 | 44.73,18.82 35.05,18.82 34.75,19.13 18.21,19.13 17.53,18.44 9.45,18.44 5.49,14.48 2.29,14.48 CN4.4
N$33
  Bottom 0.152: IC4.7 46.18,20.95 47.78,19.36 47.78,13.49 46.79,12.5 CN3.3 46.71,12.5 46.41,12.8 32.31,12.8 31.09,14.02 22.55,14.02 22.25,14.33 22.25,14.86 19.13,17.98 18.67,17.98 18.36,17.68 18.36,17.3 17.22,16.15 16.15,16.15 15.09,15.09 15.09,14.33 13.26,12.5 2.29,12.5 CN4.3
N$34
  Top 0.152: 28.96,46.02 29.18,46.02 M1LED1.K 28.96,46.02 | 28.96,46.02 26.67,46.02 M1LED2.A | 28.96,46.02 28.96,43.97 R5.2
N$35
  Top 0.152: 33.33,42.9 28.19,42.9 27.2,43.89 26.98,43.89 R5.1 | 31.77,35.59 IC7.P$4
  Top 1.778: 31.77,35.59 33.32,37.13 33.33,37.13
  Top 2.032: 33.33,37.13 33.33,42.9 M1.2
N$38
  Bottom 0.152: U$1.17 R2.2
N$39
  Top 0.152: 22.55,46.02 22.86,46.02 M2LED1.K 22.55,46.02 | 22.55,46.02 20.34,46.02 M2LED2.A | 22.55,46.02 22.55,43.97 R3.2
N$40
  Bottom 0.152: C6.1 40.08,15.47 38.18,15.47 38.1,15.39 Q2.1 38.1,15.32 36.27,13.49 33.38,13.49 U$1.7
N$41
  Top 0.152: R10.2 48.23,36.12 48.23,38.56 BATLED.K
N$42
  Top 0.406: IC6.4 IC6.3
  Top 1.93: IC7.P$8 37.91,34.54 arc90 IC6.4
N$43
  Top 0.152: 15.7,33.98 16.45,34.63 | 13.87,32.16 IC8.P$8
  Top 0.5: IC5.4 IC5.3
  Top 1.778: 13.87,32.16 16.45,34.8
  Top 2.032: 16.45,34.63 16.45,34.8 IC5.4
N$44
  Bottom 0.152: C5.1 40.08,10.44 38.18,10.44 38.1,10.52 Q2.2 38.1,10.59 36.5,12.19 U$1.8
N$45  (via drill 0.3)
  Top 0.152: v47.24,18.67 48.23,19.66 R4.2
  Bottom 0.152: v47.24,18.67 46.94,18.67 45.95,19.66 IC4.8
N$47
  Top 0.152: STAT1.K 37.87,24.61 39.62,24.61 R11.1
PWMIN1
  Top 0.152: PWMIN.1 14.78,5.03 14.78,4.57 17.83,1.52 21.26,1.52 21.87,2.13 21.87,2.52 22.94,3.58 23.77,3.58 25.22,5.03 25.22,13.64 24.84,14.02 24.36,14.02 IC1.11
  Bottom 0.152: R9.2 16,14.17 16,13.26 14.78,12.04 14.78,5.11 PWMIN.1
PWMIN2  (via drill 0.3)
  Top 0.152: v16.92,15.62 15.79,15.62 IC1.28
  Bottom 0.152: v16.92,15.62 16.92,12.27 16.08,11.43 R7.2 16,11.43 16,4.88 14.78,3.66 14.78,2.59 PWMIN.2
RESET  (via drill 0.3)
  Top 0.152: v14.55,21.26 v14.55,18.97 14.55,15.62 15.32,14.86 15.77,14.86 IC1.29 15.77,14.78 19.81,14.78 21.64,12.95 v21.64,12.42 | v28.8,7.39 v33.91,7.39
  Bottom 0.152: v14.55,21.26 13.26,22.55 R8.1 | v33.91,7.39 40.08,7.39 40.08,7.37 C1.1 | v28.8,7.39 24.61,11.58 22.48,11.58 v21.64,12.42 | v14.55,18.97 14.33,18.75 10.44,18.75 10.29,18.9 3.05,18.9 3.05,18.94 CON1.1
RX  (via drill 0.3)
  Top 0.152: v19.13,13.87 18.97,14.02 15.77,14.02 IC1.30
  Bottom 0.152: v19.13,13.87 19.13,13.64 19.51,13.26 19.51,13.11 25.91,6.71 29.72,6.71 31.01,5.41 31.01,4.65 31.77,3.89 34.82,3.89 35.97,2.74 38.48,2.74 39.24,3.5 39.3,3.5 CON2.2
SCK  (via drill 0.3)
  Top 0.152: v26.29,17.98 24.77,19.51 22.94,19.51 IC1.17 22.86,19.58 22.86,20.57 22.25,21.18 21.87,21.18 v21.26,21.79
  Bottom 0.152: v26.29,17.98 26.29,17.07 24,14.78 23.55,14.78 U$1.13 | v21.26,21.79 17.83,21.79 15.47,24.16 10.9,24.16 8.69,21.95 3.05,21.95 3.05,21.94 CON1.3
SI  (via drill 0.3)
  Top 0.152: IC1.15 24.38,17.22 v25.45,17.22 25.53,17.14 26.67,17.14 27.13,17.6 27.13,18.36 v23.01,22.48 | v19.58,24.99 v16,24.99
  Bottom 0.152: v25.45,17.22 25.22,17.22 24,16 U$1.14 | v16,24.99 3.02,24.99 CON1.5 | v19.58,24.99 20.5,24.99 v23.01,22.48
SO  (via drill 0.3)
  Top 0.152: IC1.16 24.38,18.06 v25.45,18.06 26.06,17.45 26.52,17.45 26.82,17.75 26.82,18.21 23.32,21.72 v22.1,21.72 | v17.98,24.46 v16.69,24.46
  Bottom 0.152: v25.45,18.06 25.22,18.06 24.46,17.3 23.55,17.3 U$1.15 | v16.69,24.46 10.74,24.46 9.75,23.47 3.02,23.47 CON1.4 | v17.98,24.46 18.29,24.46 18.59,24.77 19.05,24.77 v22.1,21.72
STAT-LED1  (via drill 0.3)
  Top 0.152: v20.27,25.68 15.93,25.68 15.47,25.22 15.47,23.47 13.72,21.72 13.72,12.8 15.54,10.97 17.22,10.97 IC1.1 | v22.25,25.68 22.55,25.68 23.01,26.14 34.37,26.14 35.81,24.69 35.83,24.69 STAT1.A
  Bottom 0.152: v22.25,25.68 v20.27,25.68
STAT-LED2
  Top 0.152: IC1.2 18.06,10.97 18.06,11.43 17.6,11.89 15.09,11.89 14.02,12.95 14.02,21.49 16.23,23.7 21.03,23.7 23.16,25.83 32.08,25.83 35.81,22.1 STAT2.A
TX  (via drill 0.3)
  Top 0.152: v18.97,13.03 18.82,13.18 15.77,13.18 IC1.31 | v35.2,2.74 37.03,2.74 37.8,3.5 CON2.3
  Bottom 0.152: v18.97,13.03 19.13,13.03 25.76,6.4 29.57,6.4 30.71,5.26 30.71,4.5 31.62,3.58 34.37,3.58 v35.2,2.74

### Text on the board
tPlace: input / 2-1 | 1-1 / 2-2 | 1-2 | - | +
bPlace: Motor GND | Motor VCC | voltage divider / for sensing
tNames: LED | + | + | 1 | 1 | Can | Motor Driver | Version 1.1 | Writer | CAN | CAN | GND | VCC | IN | GND | VCC | IN | GND | VCC | IN | Serial | GND | TX | RX | DTR | PWM IN
bNames: 2016/4 designed by ukai